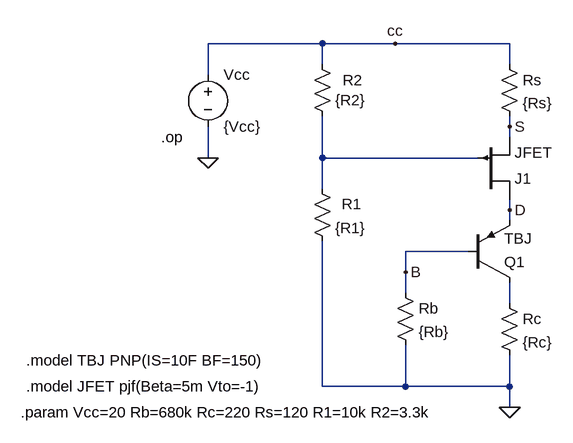
[diagram p0: schematic COMB01bop.asc]
COMB01bop.asc, the LTspice schematic file:
Version 4
SHEET 1 1608 1076
WIRE 896 -224 720 -224
WIRE 1008 -224 896 -224
WIRE 1184 -224 1008 -224
WIRE 896 -192 896 -224
WIRE 1184 -192 1184 -224
WIRE 720 -176 720 -224
WIRE 1184 -96 1184 -112
WIRE 1184 -80 1184 -96
WIRE 720 -48 720 -96
WIRE 896 -48 896 -112
WIRE 1136 -48 896 -48
WIRE 896 0 896 -48
WIRE 1184 32 1184 16
WIRE 1184 48 1184 32
WIRE 1120 96 1024 96
WIRE 1024 128 1024 96
WIRE 1024 160 1024 128
WIRE 1184 176 1184 144
WIRE 896 304 896 80
WIRE 1024 304 1024 240
WIRE 1024 304 896 304
WIRE 1184 304 1184 256
WIRE 1184 304 1024 304
WIRE 1184 336 1184 304
FLAG 1184 336 0
FLAG 720 -48 0
FLAG 1008 -224 cc
FLAG 1024 128 B
FLAG 1184 -96 S
FLAG 1184 32 D
SYMBOL res 1008 144 R0
SYMATTR InstName Rb
SYMATTR Value {Rb}
SYMBOL res 1168 160 R0
SYMATTR InstName Rc
SYMATTR Value {Rc}
SYMBOL voltage 720 -192 R0
WINDOW 123 0 0 Left 0
WINDOW 39 0 0 Left 0
SYMATTR InstName Vcc
SYMATTR Value {Vcc}
SYMBOL res 1168 -208 R0
SYMATTR InstName Rs
SYMATTR Value {Rs}
SYMBOL pnp 1120 144 M180
SYMATTR InstName Q1
SYMATTR Value TBJ
SYMBOL pjf 1136 16 M180
SYMATTR InstName J1
SYMATTR Value JFET
SYMBOL res 880 -208 R0
WINDOW 0 47 40 Left 2
WINDOW 3 36 71 Left 2
SYMATTR InstName R2
SYMATTR Value {R2}
SYMBOL res 880 -16 R0
WINDOW 0 46 39 Left 2
SYMATTR InstName R1
SYMATTR Value {R1}
TEXT 648 -80 Left 2 !.op
TEXT 440 304 Left 2 !.model JFET pjf(Beta=5m Vto=-1)
TEXT 432 344 Left 2 !.param Vcc=20 Rb=680k Rc=220 Rs=120 R1=10k R2=3.3k
TEXT 440 264 Left 2 !.model TBJ PNP(IS=10F BF=150)

The netlist it stands for:
* COMB01bop.asc
Rb B 0 {Rb}
Rc N002 0 {Rc}
Vcc cc 0 {Vcc}
Rs cc S {Rs}
Q1 N002 B D 0 TBJ
J1 D N001 S JFET
R2 cc N001 {R2}
R1 N001 0 {R1}
.model NPN NPN
.model PNP PNP
.lib standard.bjt
.model NJF NJF
.model PJF PJF
.lib standard.jft
.op
.model JFET pjf(Beta=5m Vto=-1)
.param Vcc=20 Rb=680k Rc=220 Rs=120 R1=10k R2=3.3k
.model TBJ PNP(IS=10F BF=150)
.backanno
.end